# Altium project SuperMiniCar.PrjPcb
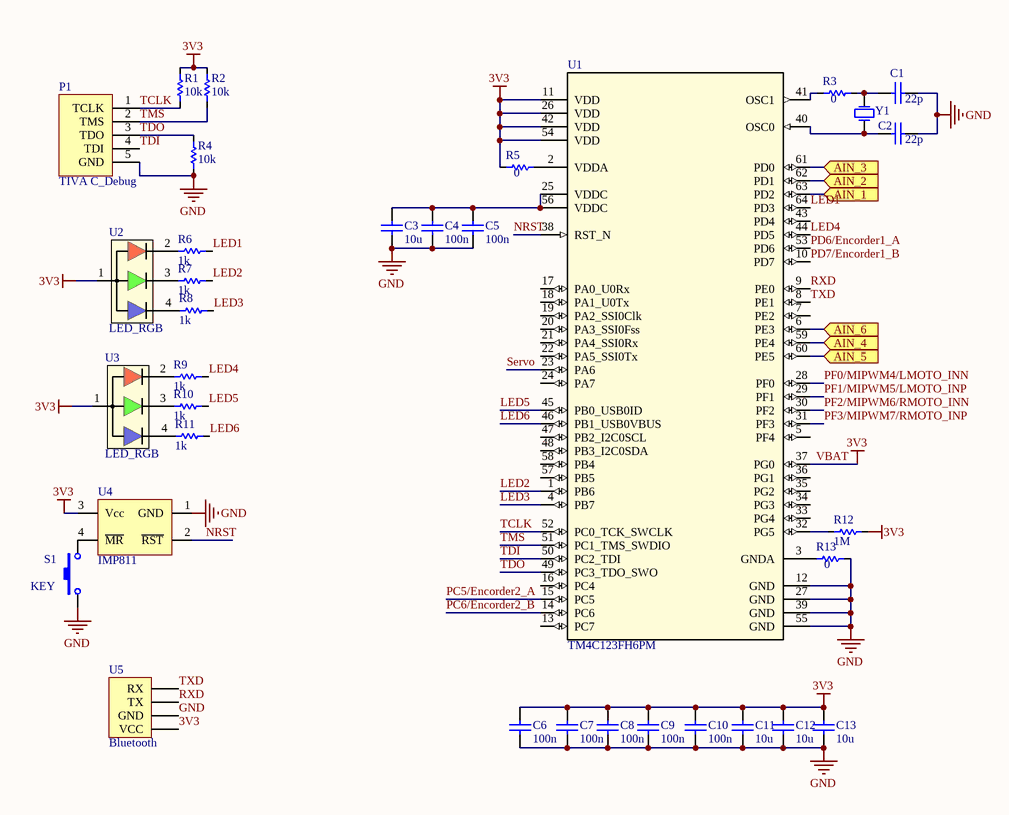
[diagram p0: MCU.SchDoc]
4 sheets, 82 parts. Net scope: global (net labels, ports and power ports of the same name join across sheets).
Board file: SuperMiniCar.PcbDoc
Sheets:
  MCU.SchDoc
  Power.SchDoc
  Sensor.SchDoc
  MotorDriver.SchDoc

## Sheet MCU.SchDoc
size A4

### Parts
C1  value 22p  [0603C]  (hidden comment: 1uF/0603/50V)
C2  value 22p  [0603C]  (hidden comment: 1uF/0603/50V)
C3  value 10u  [0603C]  (hidden comment: 1uF/0603/50V)
C4  value 100n  [0603C]  (hidden comment: 1uF/0603/50V)
C5  value 100n  [0603C]  (hidden comment: 1uF/0603/50V)
C6  value 100n  [0603C]  (hidden comment: 1uF/0603/50V)
C7  value 100n  [0603C]  (hidden comment: 1uF/0603/50V)
C8  value 100n  [0603C]  (hidden comment: 1uF/0603/50V)
C9  value 100n  [0603C]  (hidden comment: 1uF/0603/50V)
C10  value 100n  [0603C]  (hidden comment: 1uF/0603/50V)
C11  value 10u  [0603C]  (hidden comment: 1uF/0603/50V)
C12  value 10u  [0603C]  (hidden comment: 1uF/0603/50V)
C13  value 10u  [0603C]  (hidden comment: 1uF/0603/50V)
P1  TIVA C_Debug  [SMT_HEADER5]
R1  value 10k  [0603R]  (hidden comment: 1K/5%)
R2  value 10k  [0603R]  (hidden comment: 1K/5%)
R3  value 0  [0603R]  (hidden comment: 1K/5%)
R4  value 10k  [0603R]  (hidden comment: 1K/5%)
R5  value 0  [0603R]  (hidden comment: 1K/5%)
R6  value 1k  [0402]  (hidden comment: 1K/5%)
R7  value 1k  [0402]  (hidden comment: 1K/5%)
R8  value 1k  [0402]  (hidden comment: 1K/5%)
R9  value 1k  [0402]  (hidden comment: 1K/5%)
R10  value 1k  [0402]  (hidden comment: 1K/5%)
R11  value 1k  [0402]  (hidden comment: 1K/5%)
R12  value 1M  [0603R]  (hidden comment: 1K/5%)
R13  value 0  [0603R]  (hidden comment: 1K/5%)
S1  KEY  [SW-3x6mm-SMT]
U1  TM4C123FH6PM  [LQFP_64]
U2  LED_RGB  [0603 RGB]
U3  LED_RGB  [0603 RGB]
U4  IMP811  [SOT143]
U5  Bluetooth  [SMT_Female HEADER4]
Y1  XTAL  [NX5032GA]  (value not drawn)

### Ports
AIN_1 (in), AIN_2 (in), AIN_3 (in), AIN_4 (in), AIN_5 (in), AIN_6 (in)

### Nets
3V3: C6.2 C7.2 C8.2 C9.2 C10.2 C11.2 C12.2 C13.2 R1.1 R2.1 R5.2 R12.1 U1.11(VDD) U1.26(VDD) U1.37(PG0) U1.42(VDD) U1.54(VDD) U2.1(COM) U3.1(COM) U4.3(Vcc) U5.4(VCC)  [also labelled VBAT]
GND: C1.1 C2.1 C3.1 C4.1 C5.1 C6.1 C7.1 C8.1 C9.1 C10.1 C11.1 C12.1 C13.1 P1.5(GND) R4.2 R13.1 S1.2 U1.12(GND) U1.27(GND) U1.39(GND) U1.55(GND) U4.1(GND) U5.3(GND)
LED1: R6.2 U1.64(PD3)
LED2: R7.2 U1.1(PB6)
LED3: R8.2 U1.4(PB7)
LED4: R9.2 U1.44(PD5)
LED5: R10.2 U1.45(PB0_USB0ID)
LED6: R11.2 U1.46(PB1_USB0VBUS)
NRST: U1.38(RST_N) U4.2(~{RST})
PC5/Encorder2_A: U1.15(PC5)
PC6/Encorder2_B: U1.14(PC6)
PD6/Encorder1_A: U1.53(PD6)
PD7/Encorder1_B: U1.10(PD7)
PF0/MIPWM4/LMOTO_INN: U1.28(PF0)
PF1/MIPWM5/LMOTO_INP: U1.29(PF1)
PF2/MIPWM6/RMOTO_INN: U1.30(PF2)
PF3/MIPWM7/RMOTO_INP: U1.31(PF3)
RXD: U1.9(PE0) U5.2(TX)
Servo: U1.23(PA6)
TCLK: P1.1(TCLK) R1.2 U1.52(PC0_TCK_SWCLK)
TDI: P1.4(TDI) U1.50(PC2_TDI)
TDO: P1.3(TDO) R4.1 U1.49(PC3_TDO_SWO)
TMS: P1.2(TMS) R2.2 U1.51(PC1_TMS_SWDIO)
TXD: U1.8(PE1) U5.1(RX)
NetC1_2: C1.2 R3.1 Y1.2(OSC2)
NetC2_2: C2.2 U1.40(OSC0) Y1.1(OSC1)
NetC3_2: C3.2 C4.2 C5.2 U1.25(VDDC) U1.56(VDDC)
NetP5_3: U1.6(PE3) ; port AIN_6
NetR3_2: R3.2 U1.41(OSC1)
NetR5_1: R5.1 U1.2(VDDA)
NetR6_1: R6.1 U2.2
NetR7_1: R7.1 U2.3
NetR8_1: R8.1 U2.4
NetR9_1: R9.1 U3.2
NetR10_1: R10.1 U3.3
NetR11_1: R11.1 U3.4
NetR12_2: R12.2 U1.32(PG5)
NetR13_2: R13.2 U1.3(GNDA)
NetR28_1: U1.63(PD2) ; port AIN_1
NetR29_1: U1.59(PE4) ; port AIN_4
NetR32_1: U1.62(PD1) ; port AIN_2
NetR33_1: U1.60(PE5) ; port AIN_5
NetR35_1: U1.61(PD0) ; port AIN_3
NetS1_1: S1.1 U4.4(~{MR})

Not connected (* = marked no-connect by the designer): U1 5(PF4) 7(PE2) 13(PC7) 16(PC4) 17(PA0_U0Rx) 18(PA1_U0Tx) 19(PA2_SSI0Clk) 20(PA3_SSI0Fss) 21(PA4_SSI0Rx) 22(PA5_SSI0Tx) 24(PA7) 33(PG4) 34(PG3) 35(PG2) 36(PG1) 43(PD4) 47(PB2_I2C0SCL) 48(PB3_I2C0SDA) 57(PB5) 58(PB4)

### Library data of the parts
C1-C13 = Cap: Capacitor; Published: 8-Jun-2000; LatestRevisionDate: 17-Jul-2002; LatestRevisionNote: Re-released for DXP Platform.; PackageReference: RAD-0.3; Publisher: Altium Limited; PackageDescription: Radial Cap, Thru-Hole; 2 Leads; 0.3 in Pin Spacing
R1-R13 = Res1: Resistor; Published: 8-Jun-2000; LatestRevisionDate: 17-Jul-2002; LatestRevisionNote: Re-released for DXP Platform.; PackageReference: AXIAL-0.3; Publisher: Altium Limited; PackageDescription: Axial Device, Thru-Hole; 2 Leads; 0.3 in Pin Spacing
S1 = PushButton_2p: Button; Published: 24-Mar-1999; LatestRevisionDate: 17-Jul-2002; LatestRevisionNote: Re-released for DXP Platform.; PackageReference: SPST-2; Publisher: Altium Limited; PackageDescription: Switch; 2 Leads
U4 = IMP811: 复位芯片
U5 = Bluetooth: Bluetooth Module
Y1 = XTAL: Crystal Oscillator; Published: 8-Jun-2000; LatestRevisionDate: 17-Jul-2002; LatestRevisionNote: Re-released for DXP Platform.; PackageReference: R38; Publisher: Altium Limited; PackageDescription: Crystal, Thru-Hole; 2 Leads; Body 3.1 x 8.2 mm (Dia.xH)

## Sheet Power.SchDoc
size A4
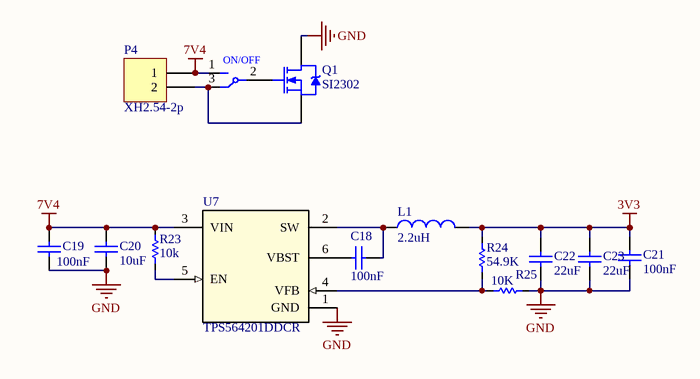
[diagram p1: Power.SchDoc]

### Parts
C18  100nF  [0603C]
C19  100nF  [0603C]
C20  value 10uF  [0805]  (hidden comment: 1uF/0603/50V)
C21  100nF  [0603C]
C22  value 22uF  [0805]  (hidden comment: 1uF/0603/50V)
C23  value 22uF  [0805]  (hidden comment: 1uF/0603/50V)
L1  2.2uH  [4020L]
P4  XH2.54-2p  [XH-2A]
Q1  SI2302  [SOT-23]
R23  10k  [0603R]
R24  54.9K  [0603R]
R25  value 10K  [0603R]  (hidden comment: 1K)
S2  slide switch  [Slide Switch]  (value not drawn)
U7  TPS564201DDCR  [SOT-23thin_L]

### Nets
3V3: C21.2 C22.2 C23.2 L1.2 R24.2
7V4: C19.1 C20.2 P4.1 R23.2 S2.1(NX) U7.3(VIN)
GND: C19.2 C20.1 C21.1 C22.1 C23.1 Q1.3(D) R25.1 U7.1(GND)
NetC18_1: C18.1 U7.6(VBST)
NetC18_2: C18.2 L1.1 U7.2(SW)
NetP4_2: P4.2 Q1.2(S) S2.3(NC)
NetQ1_1: Q1.1(G) S2.2(COM)
NetR23_1: R23.1 U7.5(EN)
NetR24_1: R24.1 R25.2 U7.4(VFB)

### Notes on the sheet
- (in symbol slide switch) ON/OFF

### Library data of the parts
C18 C19 C21 = Cap: Capacitor; Value: 100pF; Published: 8-Jun-2000; LatestRevisionDate: 17-Jul-2002; LatestRevisionNote: Re-released for DXP Platform.; PackageReference: RAD-0.3; Publisher: Altium Limited; PackageDescription: Radial Cap, Thru-Hole; 2 Leads; 0.3 in Pin Spacing
C20 C22 C23 = Cap: Capacitor; Published: 8-Jun-2000; LatestRevisionDate: 17-Jul-2002; LatestRevisionNote: Re-released for DXP Platform.; PackageReference: RAD-0.3; Publisher: Altium Limited; PackageDescription: Radial Cap, Thru-Hole; 2 Leads; 0.3 in Pin Spacing
L1 = Inductor: Code_IEC: 1005; Value: 10mH; Published: 8-Jun-2000; LatestRevisionDate: 29-May-2009; LatestRevisionNote: IPC-7351 Footprint Added.; PackageReference: 0402-A; Publisher: Altium Limited; PackageDescription: Chip Inductor; Code_JEITA: 0402
P4 = Header 2: Header, 2-Pin; LatestRevisionDate: 17-Jul-2002; LatestRevisionNote: Re-released for DXP Platform.; Publisher: Altium Limited
Q1 = NMOS_3p: N-Channel Power MOSFET; Note: Pin 2 is electrically connected to pin 4.; Published: 8-Jun-2000; LatestRevisionDate: 17-Jul-2002; LatestRevisionNote: Re-released for DXP Platform.; DatasheetVersion: PD-9.814; PackageVersion: Feb-1997; PackageReference: TO-220AB; Publisher: Altium Limited; PackageDescription: TO, Thru-Hole, Vertical, Heatsink Mounted; 3 In-Line Leads; Pitch 2.54 mm; ComponentLink1Description: Manufacturer Link; ComponentLink1URL: http://www.irf.com/
R23 R24 = Res1: Resistor; Value: 1K; Published: 8-Jun-2000; LatestRevisionDate: 17-Jul-2002; LatestRevisionNote: Re-released for DXP Platform.; PackageReference: AXIAL-0.3; Publisher: Altium Limited; PackageDescription: Axial Device, Thru-Hole; 2 Leads; 0.3 in Pin Spacing
R25 = Res1: Resistor; Published: 8-Jun-2000; LatestRevisionDate: 17-Jul-2002; LatestRevisionNote: Re-released for DXP Platform.; PackageReference: AXIAL-0.3; Publisher: Altium Limited; PackageDescription: Axial Device, Thru-Hole; 2 Leads; 0.3 in Pin Spacing
U7 = TPS564201DDCR: Imported; Manufacturer: Texas Instruments; PartNumber: TPS564201DDCR; RefDes: RefDes; TYPE: TYPE; Value: Value

## Sheet Sensor.SchDoc
size A4
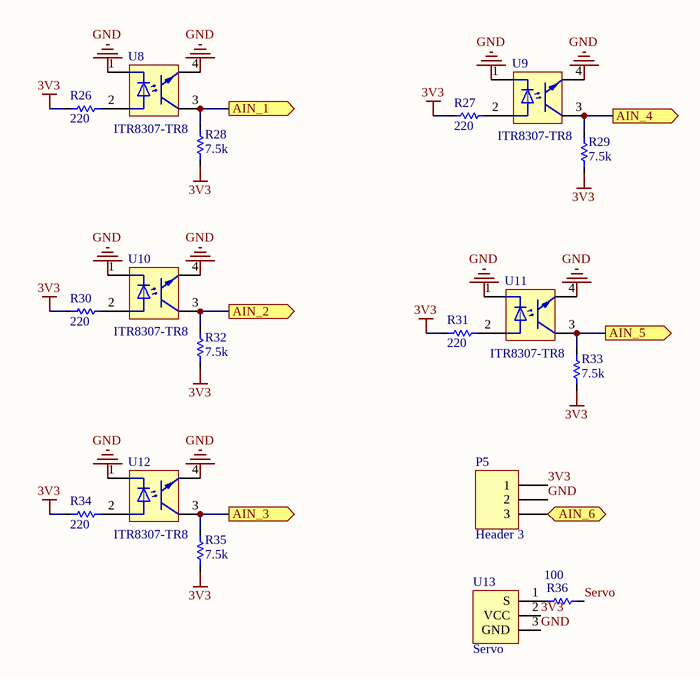
[diagram p2: Sensor.SchDoc]

### Parts
P5  Header 3  [A1.25WF-3P]
R26  220  [0603R]
R27  220  [0603R]
R28  7.5k  [0603R]
R29  7.5k  [0603R]
R30  220  [0603R]
R31  220  [0603R]
R32  7.5k  [0603R]
R33  7.5k  [0603R]
R34  220  [0603R]
R35  7.5k  [0603R]
R36  value 100  [0603R]  (hidden comment: 1K/5%)
U8  ITR8307-TR8  [SOP-4]
U9  ITR8307-TR8  [SOP-4]
U10  ITR8307-TR8  [SOP-4]
U11  ITR8307-TR8  [SOP-4]
U12  ITR8307-TR8  [SOP-4]
U13  Servo  [HDR1X3]

### Ports
AIN_1 (out), AIN_2 (out), AIN_3 (out), AIN_4 (out), AIN_5 (out), AIN_6 (out)

### Nets
3V3: P5.1 R26.2 R27.2 R28.2 R29.2 R30.2 R31.2 R32.2 R33.2 R34.2 R35.2 U13.2(VCC)
GND: P5.2 U8.1(CATHODE) U8.4(EMITTER) U9.1(CATHODE) U9.4(EMITTER) U10.1(CATHODE) U10.4(EMITTER) U11.1(CATHODE) U11.4(EMITTER) U12.1(CATHODE) U12.4(EMITTER) U13.3(GND)
Servo: R36.1
NetP5_3: P5.3 ; port AIN_6
NetR26_1: R26.1 U8.2(ANODE)
NetR27_1: R27.1 U9.2(ANODE)
NetR28_1: R28.1 U8.3(COLLECTER) ; port AIN_1
NetR29_1: R29.1 U9.3(COLLECTER) ; port AIN_4
NetR30_1: R30.1 U10.2(ANODE)
NetR31_1: R31.1 U11.2(ANODE)
NetR32_1: R32.1 U10.3(COLLECTER) ; port AIN_2
NetR33_1: R33.1 U11.3(COLLECTER) ; port AIN_5
NetR34_1: R34.1 U12.2(ANODE)
NetR35_1: R35.1 U12.3(COLLECTER) ; port AIN_3
NetR36_2: R36.2 U13.1(S)

### Library data of the parts
P5 = Header 3: Header, 3-Pin; LatestRevisionDate: 17-Jul-2002; LatestRevisionNote: Re-released for DXP Platform.; Publisher: Altium Limited
R26-R35 = Res1: Resistor; Value: 1K; Published: 8-Jun-2000; LatestRevisionDate: 17-Jul-2002; LatestRevisionNote: Re-released for DXP Platform.; PackageReference: AXIAL-0.3; Publisher: Altium Limited; PackageDescription: Axial Device, Thru-Hole; 2 Leads; 0.3 in Pin Spacing
R36 = Res1: Resistor; Published: 8-Jun-2000; LatestRevisionDate: 17-Jul-2002; LatestRevisionNote: Re-released for DXP Platform.; PackageReference: AXIAL-0.3; Publisher: Altium Limited; PackageDescription: Axial Device, Thru-Hole; 2 Leads; 0.3 in Pin Spacing

## Sheet MotorDriver.SchDoc
size A4
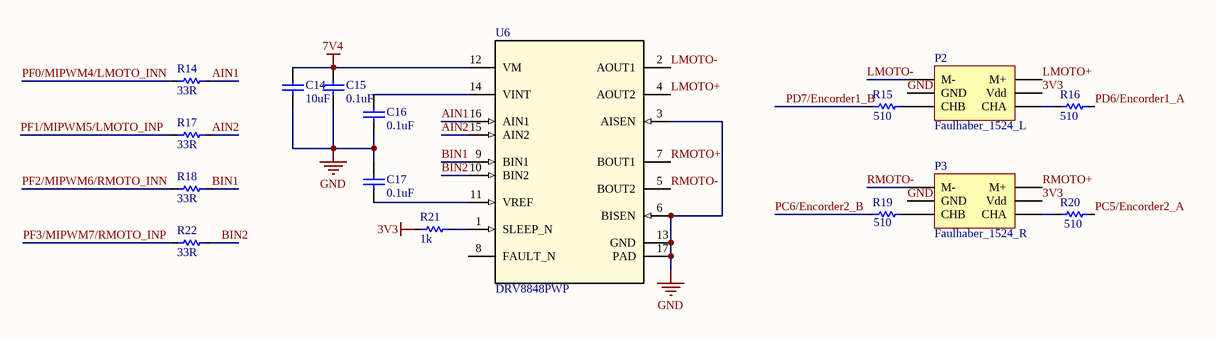
[diagram p3: MotorDriver.SchDoc]

### Parts
C14  value 10uF  [1206]  (hidden comment: 1uF/0603/50V)
C15  value 0.1uF  [0603C]  (hidden comment: 1uF/0603/50V)
C16  value 0.1uF  [0603C]  (hidden comment: 1uF/0603/50V)
C17  value 0.1uF  [0603C]  (hidden comment: 1uF/0603/50V)
P2  Faulhaber_1524_L  [HDR2X3_2.0Mm]
P3  Faulhaber_1524_R  [HDR2X3_2.0Mm]
R14  33R  [0603R]
R15  value 510  [0603R]  (hidden comment: 1K/5%)
R16  510  [0603R]
R17  33R  [0603R]
R18  33R  [0603R]
R19  value 510  [0603R]  (hidden comment: 1K/5%)
R20  value 510  [0603R]  (hidden comment: 1K/5%)
R21  1k  [0603R]
R22  33R  [0603R]
U6  DRV8848PWP  [HSSOP_N]

### Nets
3V3: P2.4(Vdd) P3.4(Vdd) R21.1
7V4: C14.1 C15.1 U6.12(VM)
GND: C14.2 C15.2 C16.2 C17.2 P2.3(GND) P3.3(GND) U6.3(AISEN) U6.6(BISEN) U6.13(GND) U6.17(PAD)
AIN1: R14.2 U6.16(AIN1)
AIN2: R17.2 U6.15(AIN2)
BIN1: R18.2 U6.9(BIN1)
BIN2: R22.2 U6.10(BIN2)
LMOTO+: P2.2(M+) U6.4(AOUT2)
LMOTO-: P2.1(M-) U6.2(AOUT1)
PC5/Encorder2_A: R20.2
PC6/Encorder2_B: R19.1
PD6/Encorder1_A: R16.2
PD7/Encorder1_B: R15.1
PF0/MIPWM4/LMOTO_INN: R14.1
PF1/MIPWM5/LMOTO_INP: R17.1
PF2/MIPWM6/RMOTO_INN: R18.1
PF3/MIPWM7/RMOTO_INP: R22.1
RMOTO+: P3.2(M+) U6.7(BOUT1)
RMOTO-: P3.1(M-) U6.5(BOUT2)
NetC16_1: C16.1 U6.14(VINT)
NetC17_1: C17.1 U6.11(VREF)
NetP2_5: P2.5(CHB) R15.2
NetP2_6: P2.6(CHA) R16.1
NetP3_5: P3.5(CHB) R19.2
NetP3_6: P3.6(CHA) R20.1
NetR21_2: R21.2 U6.1(SLEEP_N)

Not connected (* = marked no-connect by the designer): U6 8(FAULT_N)

### Library data of the parts
C14-C17 = Cap: Capacitor; Published: 8-Jun-2000; LatestRevisionDate: 17-Jul-2002; LatestRevisionNote: Re-released for DXP Platform.; PackageReference: RAD-0.3; Publisher: Altium Limited; PackageDescription: Radial Cap, Thru-Hole; 2 Leads; 0.3 in Pin Spacing
P2 P3 = Faulhaber_1524
R14 R16-R18 R22 = Res1: Resistor; Value: 1K; Published: 8-Jun-2000; LatestRevisionDate: 17-Jul-2002; LatestRevisionNote: Re-released for DXP Platform.; PackageReference: AXIAL-0.3; Publisher: Altium Limited; PackageDescription: Axial Device, Thru-Hole; 2 Leads; 0.3 in Pin Spacing
R15 R19-R21 = Res1: Resistor; Published: 8-Jun-2000; LatestRevisionDate: 17-Jul-2002; LatestRevisionNote: Re-released for DXP Platform.; PackageReference: AXIAL-0.3; Publisher: Altium Limited; PackageDescription: Axial Device, Thru-Hole; 2 Leads; 0.3 in Pin Spacing
  R21: Value: 1K
U6 = DRV8848PWP: Imported; PartNumber: DRV8848PWPR; Manufacturer: Texas Instruments; CompType: IC; PIN_COUNT: 17; Alternate_PartNumber: DRV8848PWP; PackageReference: PWP0016C; MountType: SMT; RoHS: Y; RefDes: RefDes; TYPE: TYPE; Value: Value

## Nets that join several sheets
3V3: MCU (21 pins), Power (5 pins), Sensor (12 pins), MotorDriver (P2.4 P3.4 R21.1)
7V4: Power (6 pins), MotorDriver (C14.1 C15.1 U6.12)
GND: MCU (23 pins), Power (8 pins), Sensor (12 pins), MotorDriver (10 pins)
NetP5_3: MCU (U1.6), Sensor (P5.3)
NetR28_1: MCU (U1.63), Sensor (R28.1 U8.3)
NetR29_1: MCU (U1.59), Sensor (R29.1 U9.3)
NetR32_1: MCU (U1.62), Sensor (R32.1 U10.3)
NetR33_1: MCU (U1.60), Sensor (R33.1 U11.3)
NetR35_1: MCU (U1.61), Sensor (R35.1 U12.3)
PC5/Encorder2_A: MCU (U1.15), MotorDriver (R20.2)
PC6/Encorder2_B: MCU (U1.14), MotorDriver (R19.1)
PD6/Encorder1_A: MCU (U1.53), MotorDriver (R16.2)
PD7/Encorder1_B: MCU (U1.10), MotorDriver (R15.1)
PF0/MIPWM4/LMOTO_INN: MCU (U1.28), MotorDriver (R14.1)
PF1/MIPWM5/LMOTO_INP: MCU (U1.29), MotorDriver (R17.1)
PF2/MIPWM6/RMOTO_INN: MCU (U1.30), MotorDriver (R18.1)
PF3/MIPWM7/RMOTO_INP: MCU (U1.31), MotorDriver (R22.1)
Servo: MCU (U1.23), Sensor (R36.1)